# Altium schematic sheet Power And Voltage Shifters.SchDoc: SNES TST Main
size A4; DrawnBy: Opatus; DocumentNumber: 3; Revision: Rev 1; SheetNumber: 3; SheetTotal: 4
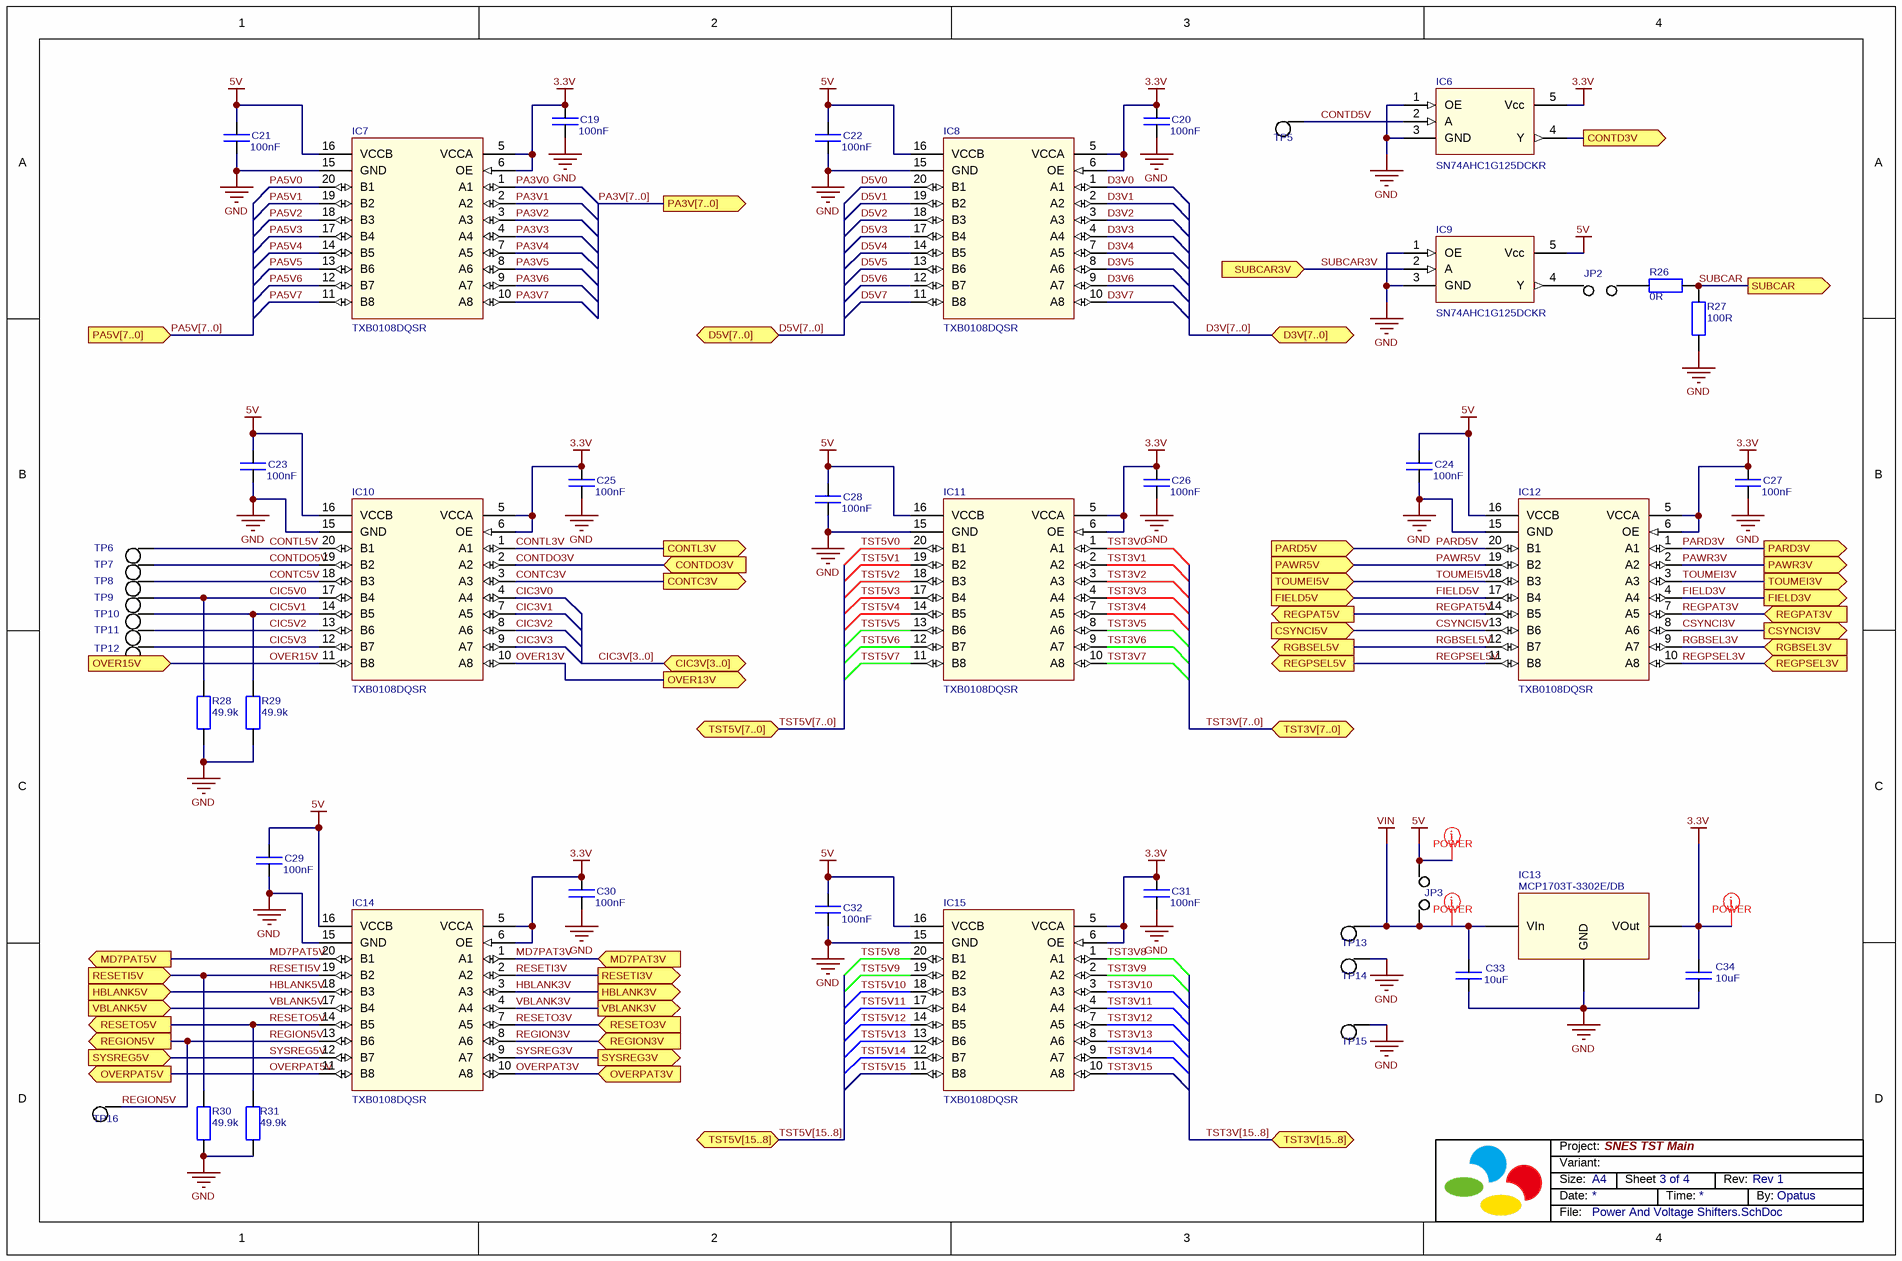
[diagram p0: Power And Voltage Shifters.SchDoc]

## Parts
C19  value 100nF  [Cap_0402_Chip]  (hidden comment: Ceramic Capacitor 100nF 10V ±20% X7R 0402)
C20  value 100nF  [Cap_0402_Chip]  (hidden comment: Ceramic Capacitor 100nF 10V ±20% X7R 0402)
C21  value 100nF  [Cap_0402_Chip]  (hidden comment: Ceramic Capacitor 100nF 10V ±20% X7R 0402)
C22  value 100nF  [Cap_0402_Chip]  (hidden comment: Ceramic Capacitor 100nF 10V ±20% X7R 0402)
C23  value 100nF  [Cap_0402_Chip]  (hidden comment: Ceramic Capacitor 100nF 10V ±20% X7R 0402)
C24  value 100nF  [Cap_0402_Chip]  (hidden comment: Ceramic Capacitor 100nF 10V ±20% X7R 0402)
C25  value 100nF  [Cap_0402_Chip]  (hidden comment: Ceramic Capacitor 100nF 10V ±20% X7R 0402)
C26  value 100nF  [Cap_0402_Chip]  (hidden comment: Ceramic Capacitor 100nF 10V ±20% X7R 0402)
C27  value 100nF  [Cap_0402_Chip]  (hidden comment: Ceramic Capacitor 100nF 10V ±20% X7R 0402)
C28  value 100nF  [Cap_0402_Chip]  (hidden comment: Ceramic Capacitor 100nF 10V ±20% X7R 0402)
C29  value 100nF  [Cap_0402_Chip]  (hidden comment: Ceramic Capacitor 100nF 10V ±20% X7R 0402)
C30  value 100nF  [Cap_0402_Chip]  (hidden comment: Ceramic Capacitor 100nF 10V ±20% X7R 0402)
C31  value 100nF  [Cap_0402_Chip]  (hidden comment: Ceramic Capacitor 100nF 10V ±20% X7R 0402)
C32  value 100nF  [Cap_0402_Chip]  (hidden comment: Ceramic Capacitor 100nF 10V ±20% X7R 0402)
C33  value 10uF  [Cap_1206_Chip]  (hidden comment: Ceramic Capacitor 10uF 25V ±20% X7R 1206)
C34  value 10uF  [Cap_0805_Chip]  (hidden comment: Ceramic Capacitor 10uF 10V ±20% X7R 0805)
IC6  Manufacturer_Part_Number: SN74AHC1G125DCKR  [SC70]  (hidden comment: SN74AHC1G125)
IC7  TXB0108DQSR  [SON20]
IC8  TXB0108DQSR  [SON20]
IC9  Manufacturer_Part_Number: SN74AHC1G125DCKR  [SC70]  (hidden comment: SN74AHC1G125)
IC10  TXB0108DQSR  [SON20]
IC11  TXB0108DQSR  [SON20]
IC12  TXB0108DQSR  [SON20]
IC13  Manufacturer_Part_Number: MCP1703T-3302E/DB  [SOT223-3]  (hidden comment: MCP1703T)
IC14  TXB0108DQSR  [SON20]
IC15  TXB0108DQSR  [SON20]
JP2  Jumper  [Jumper]  (value not drawn)  (no BOM)
JP3  Jumper  [Jumper Big]  (value not drawn)  (no BOM)
R26  value 0R  [Res_0603_Chip]  (hidden comment: Resistor 0R 0603 ±1%)
R27  value 100R  [Res_0603_Chip]  (hidden comment: Resistor 100R 0603 ±1%)
R28  value 49.9k  [Res_0402_Chip]  (hidden comment: Resistor 49.9k 0402 ±1%)
R29  value 49.9k  [Res_0402_Chip]  (hidden comment: Resistor 49.9k 0402 ±1%)
R30  value 49.9k  [Res_0402_Chip]  (hidden comment: Resistor 49.9k 0402 ±1%)
R31  value 49.9k  [Res_0402_Chip]  (hidden comment: Resistor 49.9k 0402 ±1%)
TP5  Pin Connector  [Pin Connector Small]  (value not drawn)  (no BOM)
TP6  Pin Connector  [Pin Connector Small]  (value not drawn)  (no BOM)
TP7  Pin Connector  [Pin Connector Small]  (value not drawn)  (no BOM)
TP8  Pin Connector  [Pin Connector Small]  (value not drawn)  (no BOM)
TP9  Pin Connector  [Pin Connector Small]  (value not drawn)  (no BOM)
TP10  Pin Connector  [Pin Connector Small]  (value not drawn)  (no BOM)
TP11  Pin Connector  [Pin Connector Small]  (value not drawn)  (no BOM)
TP12  Pin Connector  [Pin Connector Small]  (value not drawn)  (no BOM)
TP13  Pin Connector  [Pin Connector Small]  (value not drawn)  (no BOM)
TP14  Pin Connector  [Pin Connector Small]  (value not drawn)  (no BOM)
TP15  Pin Connector  [Pin Connector Small]  (value not drawn)  (no BOM)
TP16  Pin Connector  [Pin Connector Small]  (value not drawn)  (no BOM)

## Ports
CIC3V[3..0] (bidir), CONTC3V (out), CONTD3V (out), CONTDO3V (in), CONTL3V (out), CSYNCI3V (out), CSYNCI5V (in), D3V[7..0] (bidir), D5V[7..0] (bidir), FIELD3V (out), FIELD5V (in), HBLANK3V (out), HBLANK5V (in), MD7PAT3V (in), MD7PAT5V (out), OVER13V (out), OVER15V (in), OVERPAT3V (in), OVERPAT5V (out), PA3V[7..0] (out), PA5V[7..0] (in), PARD3V (out), PARD5V (in), PAWR3V (out), PAWR5V (in), REGION3V (in), REGION5V (out), REGPAT3V (in), REGPAT5V (out), REGPSEL3V (in), REGPSEL5V (out), RESETI3V (out), RESETI5V (in), RESETO3V (in), RESETO5V (out), RGBSEL3V (in), RGBSEL5V (out), SUBCAR3V (in), SUBCAR (out), SYSREG3V (out), SYSREG5V (in), TOUMEI3V (out), TOUMEI5V (in), TST3V[7..0] (bidir), TST3V[15..8] (bidir), TST5V[7..0] (bidir), TST5V[15..8] (bidir), VBLANK3V (out), VBLANK5V (in)

## Nets
3.3V: C19.1 C20.1 C25.1 C26.1 C27.1 C30.1 C31.1 C34.2 IC6.5(Vcc) IC7.5(VCCA) IC7.6(OE) IC8.5(VCCA) IC8.6(OE) IC10.5(VCCA) IC10.6(OE) IC11.5(VCCA) IC11.6(OE) IC12.5(VCCA) IC12.6(OE) IC13.3(VOut) IC14.5(VCCA) IC14.6(OE) IC15.5(VCCA) IC15.6(OE)
5V: C21.1 C22.1 C23.1 C24.1 C28.1 C29.1 C32.1 IC7.16(VCCB) IC8.16(VCCB) IC9.5(Vcc) IC10.16(VCCB) IC11.16(VCCB) IC12.16(VCCB) IC14.16(VCCB) IC15.16(VCCB) JP3.1
GND: C19.2 C20.2 C21.2 C22.2 C23.2 C24.2 C25.2 C26.2 C27.2 C28.2 C29.2 C30.2 C31.2 C32.2 C33.1 C34.1 IC6.1(OE) IC6.3(GND) IC7.15(GND) IC8.15(GND) IC9.1(OE) IC9.3(GND) IC10.15(GND) IC11.15(GND) IC12.15(GND) IC13.2(GND) IC14.15(GND) IC15.15(GND) R27.2 R28.1 R29.1 R30.2 R31.1 TP14.1 TP15.1
VIN: C33.2 IC13.1(VIn) JP3.2 TP13.1
CIC3V0: IC10.4(A4)
CIC3V1: IC10.7(A5)
CIC3V2: IC10.8(A6)
CIC3V3: IC10.9(A7)
CIC5V0: IC10.17(B4) R28.2 TP9.1
CIC5V1: IC10.14(B5) R29.2 TP10.1
CIC5V2: IC10.13(B6) TP11.1
CIC5V3: IC10.12(B7) TP12.1
CONTC3V: IC10.3(A3) ; port CONTC3V
CONTC5V: IC10.18(B3) TP8.1
CONTD3V: IC6.4(Y) ; port CONTD3V
CONTD5V: IC6.2(A) TP5.1
CONTDO3V: IC10.2(A2) ; port CONTDO3V
CONTDO5V: IC10.19(B2) TP7.1
CONTL3V: IC10.1(A1) ; port CONTL3V
CONTL5V: IC10.20(B1) TP6.1
CSYNCI3V: IC12.8(A6) ; port CSYNCI3V
CSYNCI5V: IC12.13(B6) ; port CSYNCI5V
D3V0: IC8.1(A1)
D3V1: IC8.2(A2)
D3V2: IC8.3(A3)
D3V3: IC8.4(A4)
D3V4: IC8.7(A5)
D3V5: IC8.8(A6)
D3V6: IC8.9(A7)
D3V7: IC8.10(A8)
D5V0: IC8.20(B1)
D5V1: IC8.19(B2)
D5V2: IC8.18(B3)
D5V3: IC8.17(B4)
D5V4: IC8.14(B5)
D5V5: IC8.13(B6)
D5V6: IC8.12(B7)
D5V7: IC8.11(B8)
FIELD3V: IC12.4(A4) ; port FIELD3V
FIELD5V: IC12.17(B4) ; port FIELD5V
HBLANK3V: IC14.3(A3) ; port HBLANK3V
HBLANK5V: IC14.18(B3) ; port HBLANK5V
MD7PAT3V: IC14.1(A1) ; port MD7PAT3V
MD7PAT5V: IC14.20(B1) ; port MD7PAT5V
OVER13V: IC10.10(A8) ; port OVER13V
OVER15V: IC10.11(B8) ; port OVER15V
OVERPAT3V: IC14.10(A8) ; port OVERPAT3V
OVERPAT5V: IC14.11(B8) ; port OVERPAT5V
PA3V0: IC7.1(A1)
PA3V1: IC7.2(A2)
PA3V2: IC7.3(A3)
PA3V3: IC7.4(A4)
PA3V4: IC7.7(A5)
PA3V5: IC7.8(A6)
PA3V6: IC7.9(A7)
PA3V7: IC7.10(A8)
PA5V0: IC7.20(B1)
PA5V1: IC7.19(B2)
PA5V2: IC7.18(B3)
PA5V3: IC7.17(B4)
PA5V4: IC7.14(B5)
PA5V5: IC7.13(B6)
PA5V6: IC7.12(B7)
PA5V7: IC7.11(B8)
PARD3V: IC12.1(A1) ; port PARD3V
PARD5V: IC12.20(B1) ; port PARD5V
PAWR3V: IC12.2(A2) ; port PAWR3V
PAWR5V: IC12.19(B2) ; port PAWR5V
REGION3V: IC14.8(A6) ; port REGION3V
REGION5V: IC14.13(B6) TP16.1 ; port REGION5V
REGPAT3V: IC12.7(A5) ; port REGPAT3V
REGPAT5V: IC12.14(B5) ; port REGPAT5V
REGPSEL3V: IC12.10(A8) ; port REGPSEL3V
REGPSEL5V: IC12.11(B8) ; port REGPSEL5V
RESETI3V: IC14.2(A2) ; port RESETI3V
RESETI5V: IC14.19(B2) R30.1 ; port RESETI5V
RESETO3V: IC14.7(A5) ; port RESETO3V
RESETO5V: IC14.14(B5) R31.2 ; port RESETO5V
RGBSEL3V: IC12.9(A7) ; port RGBSEL3V
RGBSEL5V: IC12.12(B7) ; port RGBSEL5V
SUBCAR: R26.1 R27.1 ; port SUBCAR
SUBCAR3V: IC9.2(A) ; port SUBCAR3V
SYSREG3V: IC14.9(A7) ; port SYSREG3V
SYSREG5V: IC14.12(B7) ; port SYSREG5V
TOUMEI3V: IC12.3(A3) ; port TOUMEI3V
TOUMEI5V: IC12.18(B3) ; port TOUMEI5V
TST3V0: IC11.1(A1)
TST3V1: IC11.2(A2)
TST3V2: IC11.3(A3)
TST3V3: IC11.4(A4)
TST3V4: IC11.7(A5)
TST3V5: IC11.8(A6)
TST3V6: IC11.9(A7)
TST3V7: IC11.10(A8)
TST3V8: IC15.1(A1)
TST3V9: IC15.2(A2)
TST3V10: IC15.3(A3)
TST3V11: IC15.4(A4)
TST3V12: IC15.7(A5)
TST3V13: IC15.8(A6)
TST3V14: IC15.9(A7)
TST3V15: IC15.10(A8)
TST5V0: IC11.20(B1)
TST5V1: IC11.19(B2)
TST5V2: IC11.18(B3)
TST5V3: IC11.17(B4)
TST5V4: IC11.14(B5)
TST5V5: IC11.13(B6)
TST5V6: IC11.12(B7)
TST5V7: IC11.11(B8)
TST5V8: IC15.20(B1)
TST5V9: IC15.19(B2)
TST5V10: IC15.18(B3)
TST5V11: IC15.17(B4)
TST5V12: IC15.14(B5)
TST5V13: IC15.13(B6)
TST5V14: IC15.12(B7)
TST5V15: IC15.11(B8)
VBLANK3V: IC14.4(A4) ; port VBLANK3V
VBLANK5V: IC14.17(B4) ; port VBLANK5V
NetIC9_4: IC9.4(Y) JP2.2
NetJP2_1: JP2.1 R26.2

## Buses and harness runs
bus CIC3V[3..0] = port CIC3V[3..0]
bus D3V[7..0] = port D3V[7..0]
bus D5V[7..0] = port D5V[7..0]
bus PA3V[7..0] = port PA3V[7..0]
bus PA5V[7..0] = port PA5V[7..0]
bus TST3V[7..0] = port TST3V[7..0]
bus TST3V[15..8] = port TST3V[15..8]
bus TST5V[7..0] = port TST5V[7..0]
bus TST5V[15..8] = port TST5V[15..8]

## Layout directives
net class POWER: 3.3V, 5V, VIN

## Notes on the sheet
- Size:
- Date:
- Variant:
- Project:
- A4
- Sheet
- Time:
- Rev:
- By:
- File:

## Library data of the parts
C19-C32 = Capacitor: ChipSize: 0402; NominalVoltage: 10V; Dielectric: X7R; Tolerance: ±20%; PartType: Ceramic Capacitor
C33 = Capacitor: ChipSize: 1206; NominalVoltage: 25V; Dielectric: X7R; Tolerance: ±20%; PartType: Ceramic Capacitor
C34 = Capacitor: ChipSize: 0805; NominalVoltage: 10V; Dielectric: X7R; Tolerance: ±20%; PartType: Ceramic Capacitor
IC6 IC9 = SN74AHC1G125: Non-inverting buffer; Vendor: Texas Instruments
IC7 IC8 IC10-IC12 IC14 IC15 = TXB0108DQSR: 8-bit level shifter; Vendor: Texas Instruments; Manufacturer_Part_Number: TXB0108DQSR
IC13 = MCP1703 SOT223: 3.3V Regulator; Vendor: Microchip
R26 R27 = R: ChipSize: 0603; Tolerance: ±1%; PartType: Resistor
R28-R31 = R: ChipSize: 0402; Tolerance: ±1%; PartType: Resistor